# Altium schematic sheet S02-INTERFACES.SchDoc
size B; SheetNumber: 3; SheetTotal: 4; BLOCK-TITLE: TRANSCEIVER SERIAL WIRE DEBUG PORT; BLOCK-SIZE: B; BLOCK-PROJECT: MULTIMOD RADIO MODULE; BLOCK-REVISION: 1; BLOCK-ORGANIZATION: UNIVERSITY OF FLORIDA; BLOCK-DESIGNER: MEHRON TALEBI; BLOCK-IDENTIFIER: SUMMER 2023; BLOCK-REVIEWER: MIKE STAPLETON
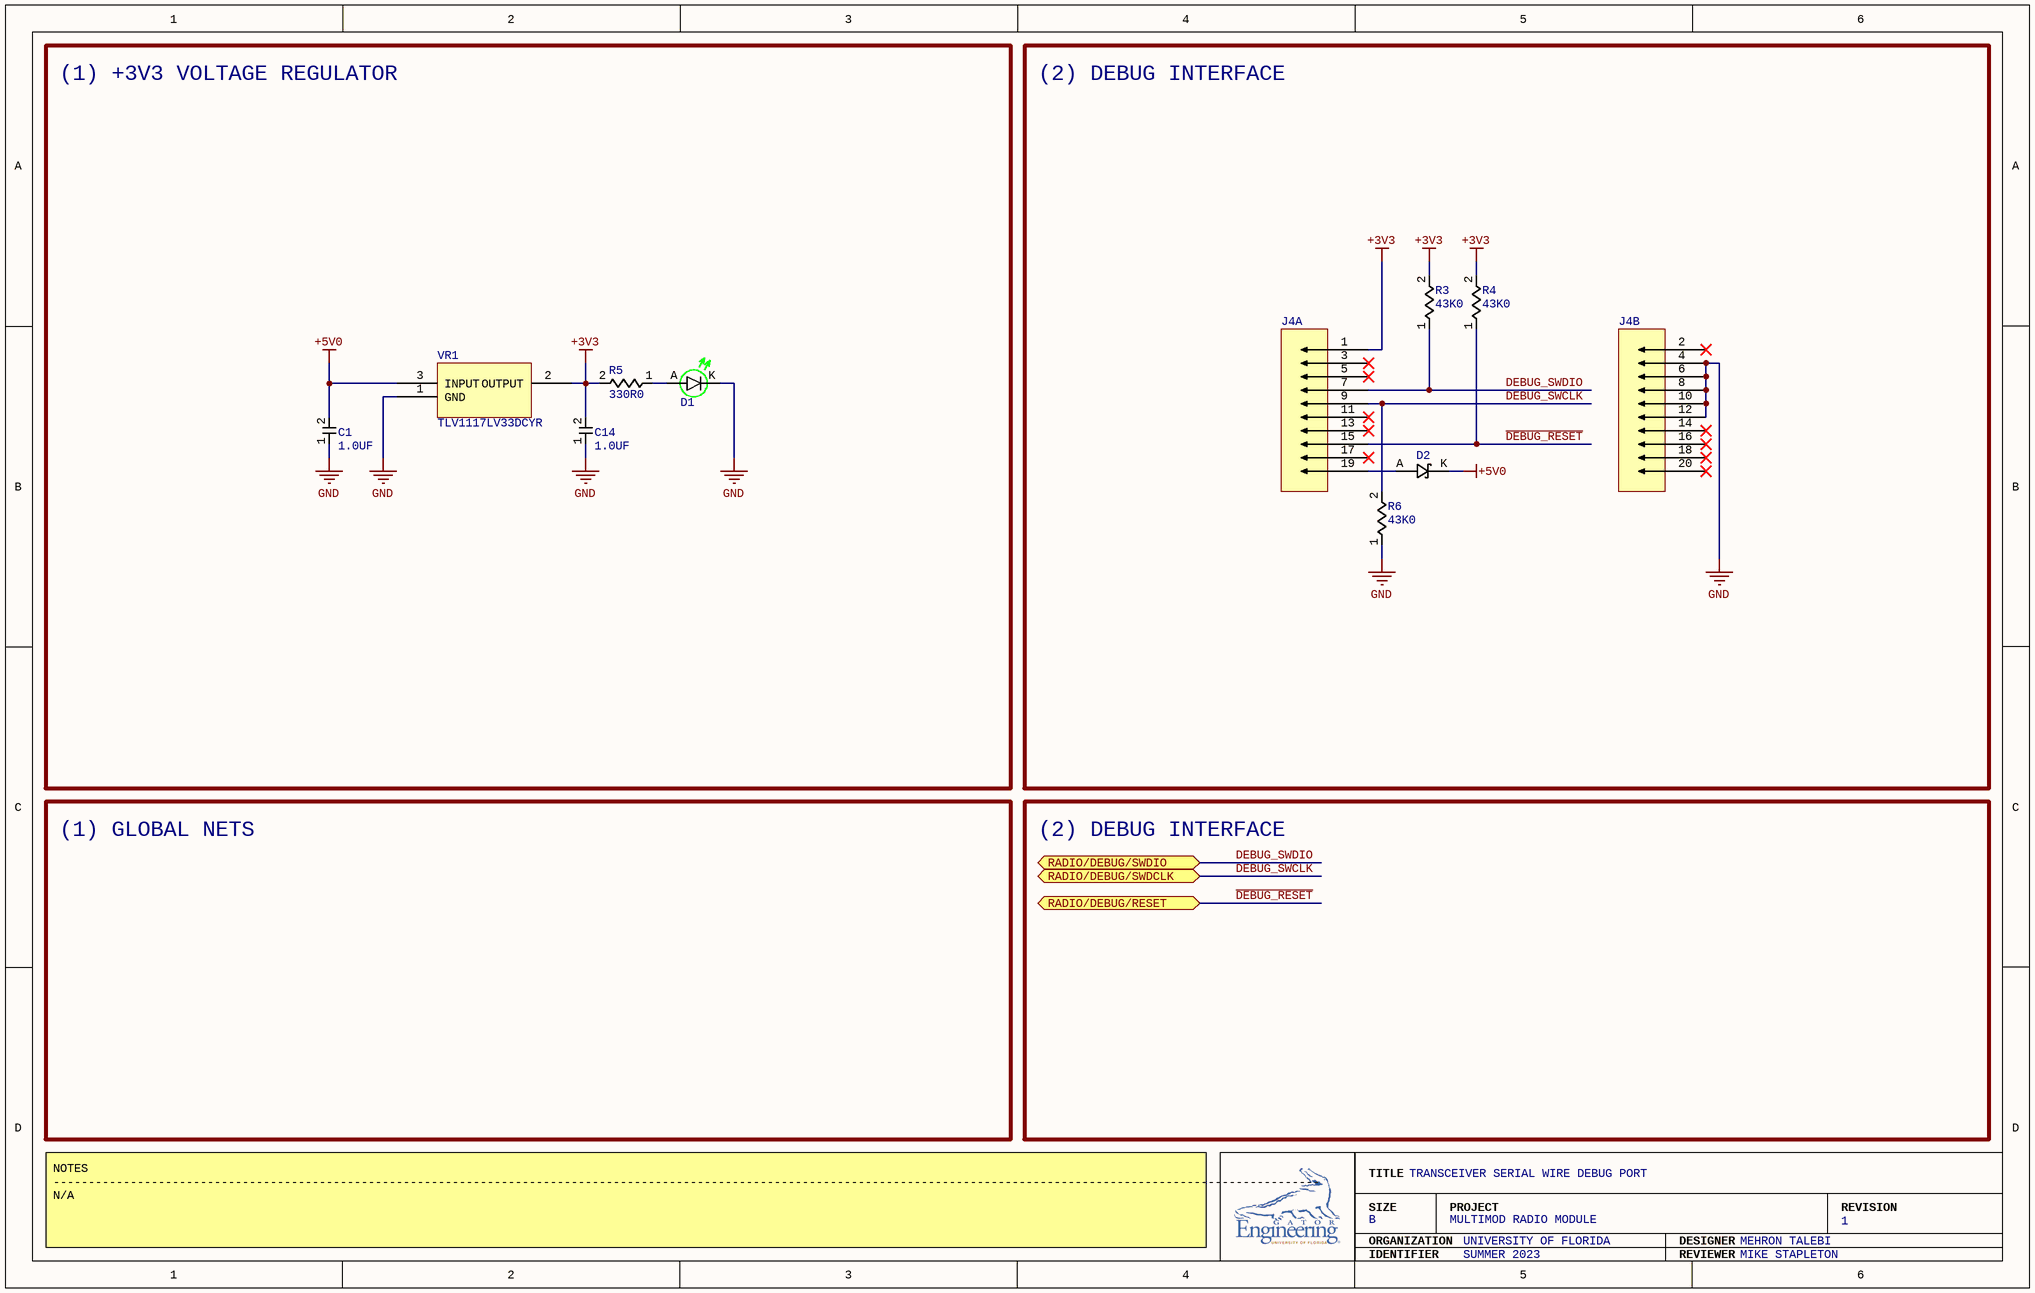
[diagram p0: S02-INTERFACES.SchDoc]

## Parts
C1  1.0UF  [CL21B105KAFNFNE]
C14  1.0UF  [CL21B105KAFNFNE]
D1  LTST-C171GKT  [LTST-C171GKT]  (value not drawn)
D2  RBR5L30BDDTE25  [RBR5L30BDDTE25]  (value not drawn)
J4  3020-20-0300-00  [3020-20-0300-00]  (value not drawn)  (parts A,B of 2)
R3  43K0  [RT0805BRD0743KL]
R4  43K0  [RT0805BRD0743KL]
R5  330R0  [RC0805FR-7W330RL]
R6  43K0  [RT0805BRD0743KL]
VR1  TLV1117LV33DCYR  [TLV1117LV33DCYR]

## Blocks framed on the sheet
(1) +3V3 VOLTAGE REGULATOR: C1 C14 D1 R5 VR1
(2) DEBUG INTERFACE: D2 J4 R3 R4 R6

## Ports
RADIO/DEBUG/RESET (bidir), RADIO/DEBUG/SWDCLK (bidir), RADIO/DEBUG/SWDIO (bidir)

## Nets
+3V3: C14.2 J4.1 R3.2 R4.2 R5.2 VR1.2(OUTPUT)
+5V0: C1.2 D2.K(+) VR1.3(INPUT)
GND: C1.1 C14.1 D1.K J4.4 J4.6 J4.8 J4.10 J4.12 R6.1 VR1.1(GND)
~{DEBUG_RESET}: J4.15 R4.1 ; port RADIO/DEBUG/RESET
DEBUG_SWCLK: J4.9 R6.2 ; port RADIO/DEBUG/SWDCLK
DEBUG_SWDIO: J4.7 R3.1 ; port RADIO/DEBUG/SWDIO
NetD1_A: D1.A R5.1
NetD2_A: D2.A(-) J4.19

Not connected (* = marked no-connect by the designer): J4 2* 3* 5* 11* 13* 14* 16* 17* 18* 20*

## Notes on the sheet
- (1) GLOBAL NETS
- (2) DEBUG INTERFACE
- NOTES
  -------------------------------------------------------------------------------------------------------------------------------------------------------------------------------------
  N/A
- TITLE
- SIZE
- ORGANIZATION
- PROJECT
- DESIGNER
- REVISION
- IDENTIFIER
- REVIEWER

## Library data of the parts
C1 C14 = CL21B105KAFNFNE: CAP CER 1UF 25V X7R 0805; Capacitance: 1 µF; Tolerance: ±10%; Voltage - Rated: 25V; Temperature Coefficient: X7R; Operating Temperature: -55°C ~ 125°C; Applications: General Purpose; Mounting Type: Surface Mount, MLCC; Package / Case: 0805 (2012 Metric); Size / Dimension: 0.079" L x 0.049" W (2.00mm x 1.25mm); Thickness (Max): 0.053" (1.35mm); Supplier 1: Arrow Electronics; Supplier Part Number 1: CL21B105KAFNFNE
D1 = LTST-C171GKT: LED GREEN CLEAR CHIP SMD; Configuration: Standard; Lens Color: Colorless; Millicandela Rating: 12mcd; Lens Style: Rectangle with Flat Top; Lens Size: 1.40mm x 1.25mm; Voltage - Forward (Vf) (Typ): 2.1V; Current - Test: 20mA; Viewing Angle: 130°; Wavelength - Dominant: 569nm; Wavelength - Peak: 565nm; Color: Green; Lens Transparency: Clear; Mounting Type: Surface Mount; Package / Case: 0805 (2012 Metric); Supplier Device Package: Chip LED; Size / Dimension: 2.00mm L x 1.25mm W; Height (Max): 0.90mm; Supplier 1: Digi-Key; Supplier Part Number 1: 160-1423-1-ND
D2 = RBR5L30BDDTE25: DIODE SCHOTTKY 30V 5A PMDS; Voltage - Forward (Vf) (Max) @ If: 490 mV @ 5 A; Speed: Fast Recovery =< 500ns, > 200mA (Io); Current - Reverse Leakage @ Vr: 150 µA @ 30 V; Diode Type: Schottky; Voltage - DC Reverse (Vr) (Max): 30 V; Current - Average Rectified (Io): 5A; Mounting Type: Surface Mount; Package / Case: DO-214AC, SMA; Operating Temperature - Junction: -55°C ~ 150°C; Supplier 1: Digi-Key; Supplier Part Number 1: 846-RBR5L30BDDTE25CT-ND
J4 = 3020-20-0300-00: CONN HEADER SMD 20POS 2.54MM; Pitch - Mating: 0.100" (2.54mm); Number of Positions: 20; Number of Positions Loaded: All; Style: Board to Cable/Wire; Shrouding: Shrouded - 4 Wall; Material Flammability Rating: UL94 V-0; Current Rating (Amps): 3A (AC/DC); Connector Type: Header; Contact Type: Male Pin; Number of Rows: 2; Row Spacing - Mating: 0.100" (2.54mm); Mounting Type: Surface Mount; Termination: Solder; Fastening Type: Push-Pull; Insulation Height: 0.354" (9.00mm); Contact Shape: Square; Contact Finish - Mating: Gold; Contact Finish Thickness - Mating: Flash; Contact Finish - Post: Gold; Contact Material: Brass; Insulation Material: Polyamide (PA9T), Nylon 9T; Features: Keying Slot; Operating Temperature: -40°C ~ 105°C; Insulation Color: Black; Contact Finish Thickness - Post: Flash; Supplier 1: Digi-Key; Supplier Part Number 1: 1175-1623-ND
R3 R4 R6 = RT0805BRD0743KL: RES SMD 43K OHM 0.1% 1/8W 0805; Resistance: 43 kOhms; Power (Watts): 0.125W, 1/8W; Temperature Coefficient: ±25ppm/°C; Tolerance: ±0.1%; Composition: Thin Film; Operating Temperature: -55°C ~ 155°C; Supplier Device Package: 0805 (2012 Metric); Size / Dimension: 0.079" L x 0.049" W (2.00mm x 1.25mm); Height - Seated (Max): 0.024" (0.60mm); Number of Terminations: 2; Supplier 1: Mouser; Supplier Part Number 1: 603-RT0805BRD0743KL
R5 = RC0805FR-7W330RL: RES 330 OHM 1% 1/4W 0805; Resistance: 330 Ohms; Power (Watts): 0.25W, 1/4W; Temperature Coefficient: ±100ppm/°C; Tolerance: ±1%; Composition: Thick Film; Features: Moisture Resistant; Operating Temperature: -55°C ~ 155°C; Supplier Device Package: 0805; Size / Dimension: 0.079" L x 0.049" W (2.00mm x 1.25mm); Height - Seated (Max): 0.024" (0.60mm); Number of Terminations: 2; Supplier 1: Mouser; Supplier Part Number 1: 603-RC0805FR-7W330RL
VR1 = TLV1117LV33DCYR: IC REG LINEAR 3.3V 1A SOT223-4; Output Configuration: Positive; Output Type: Fixed; Number of Regulators: 1; Voltage - Input (Max): 5.5V; Voltage Dropout (Max): 1.3V @ 800mA; Current - Quiescent (Iq): 100 µA; PSRR: 75dB (120Hz); Protection Features: Over Current, Over Temperature; Voltage - Output (Min/Fixed): 3.3V; Current - Output: 1A; Operating Temperature: -40°C ~ 125°C; Mounting Type: Surface Mount; Package / Case: TO-261-4, TO-261AA; ComponentLink1Description: Datasheet; ComponentLink1URL: https://www.ti.com/lit/ds/symlink/tlv1117lv.pdf; Supplier 1: Digi-Key; Supplier Part Number 1: 296-28778-1-ND